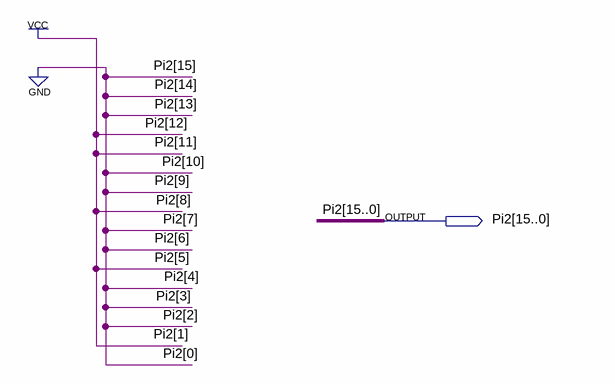
[diagram p0: schematic sheet]
// Quartus schematic Pi_div_2.bdf as structural Verilog: 0 symbols, 1 pins
module Pi_div_2 (
  output [15:0] Pi2
);


  assign Pi2 = 16'b0001100100100010;
endmodule
